# EasyEDA Pro project ProPrj_PCB_2025-05-19.epro, board 手掌0.1
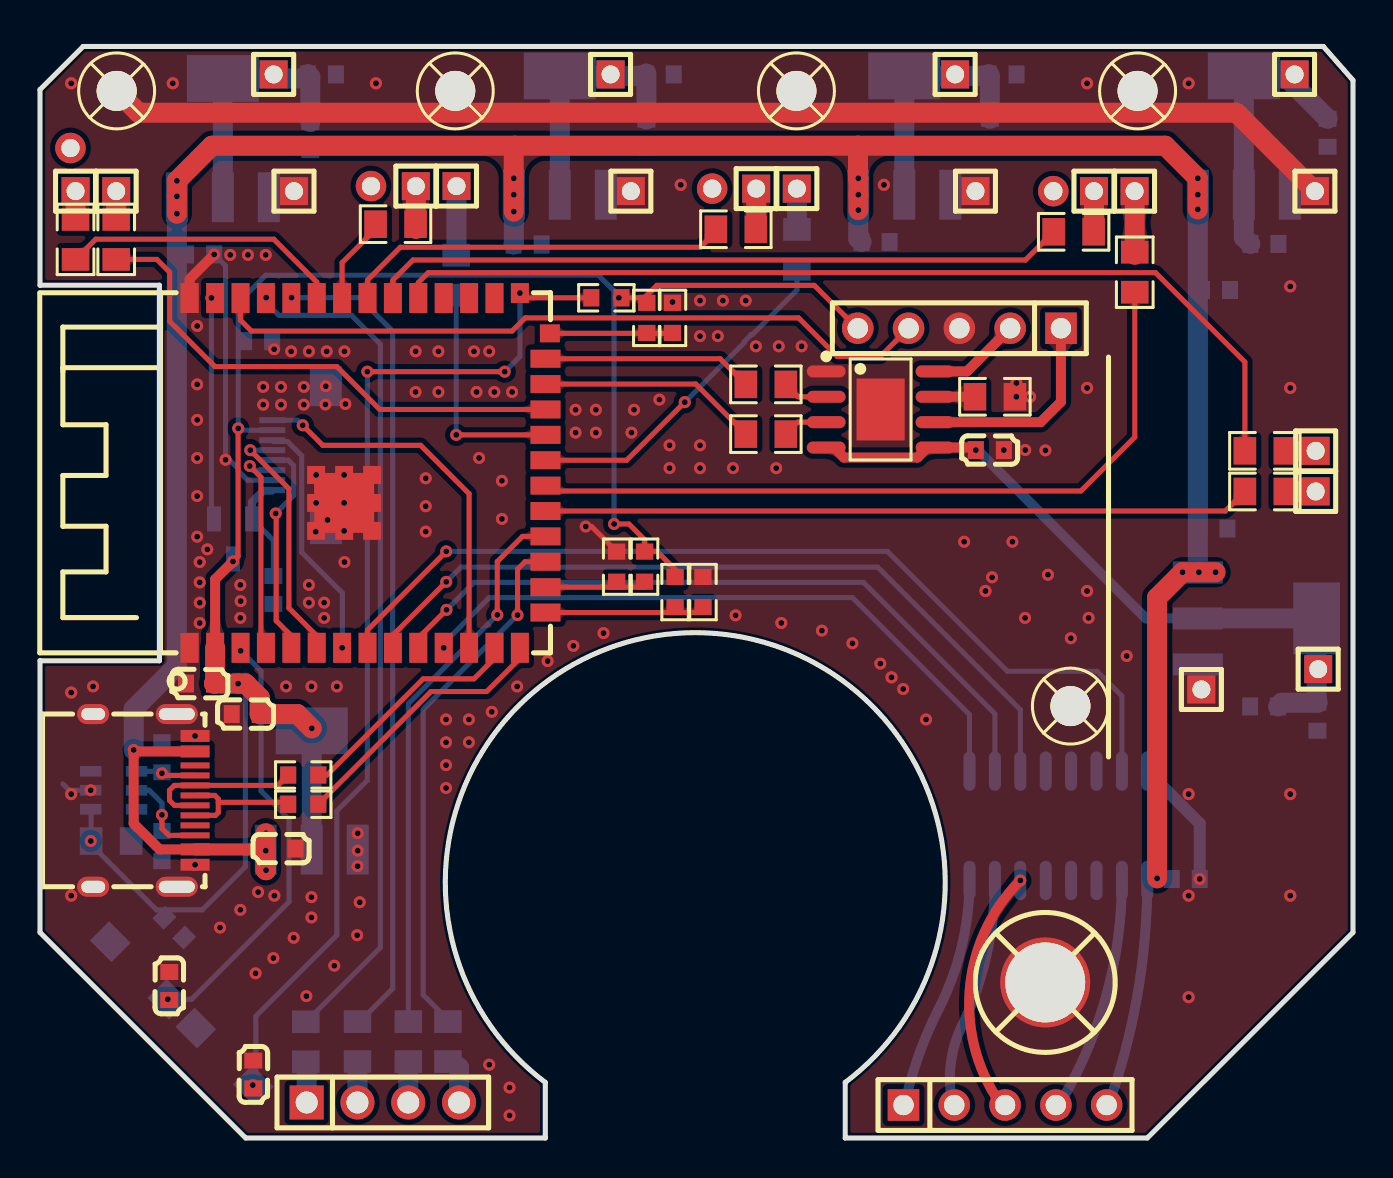
[diagram p4: board, top side]
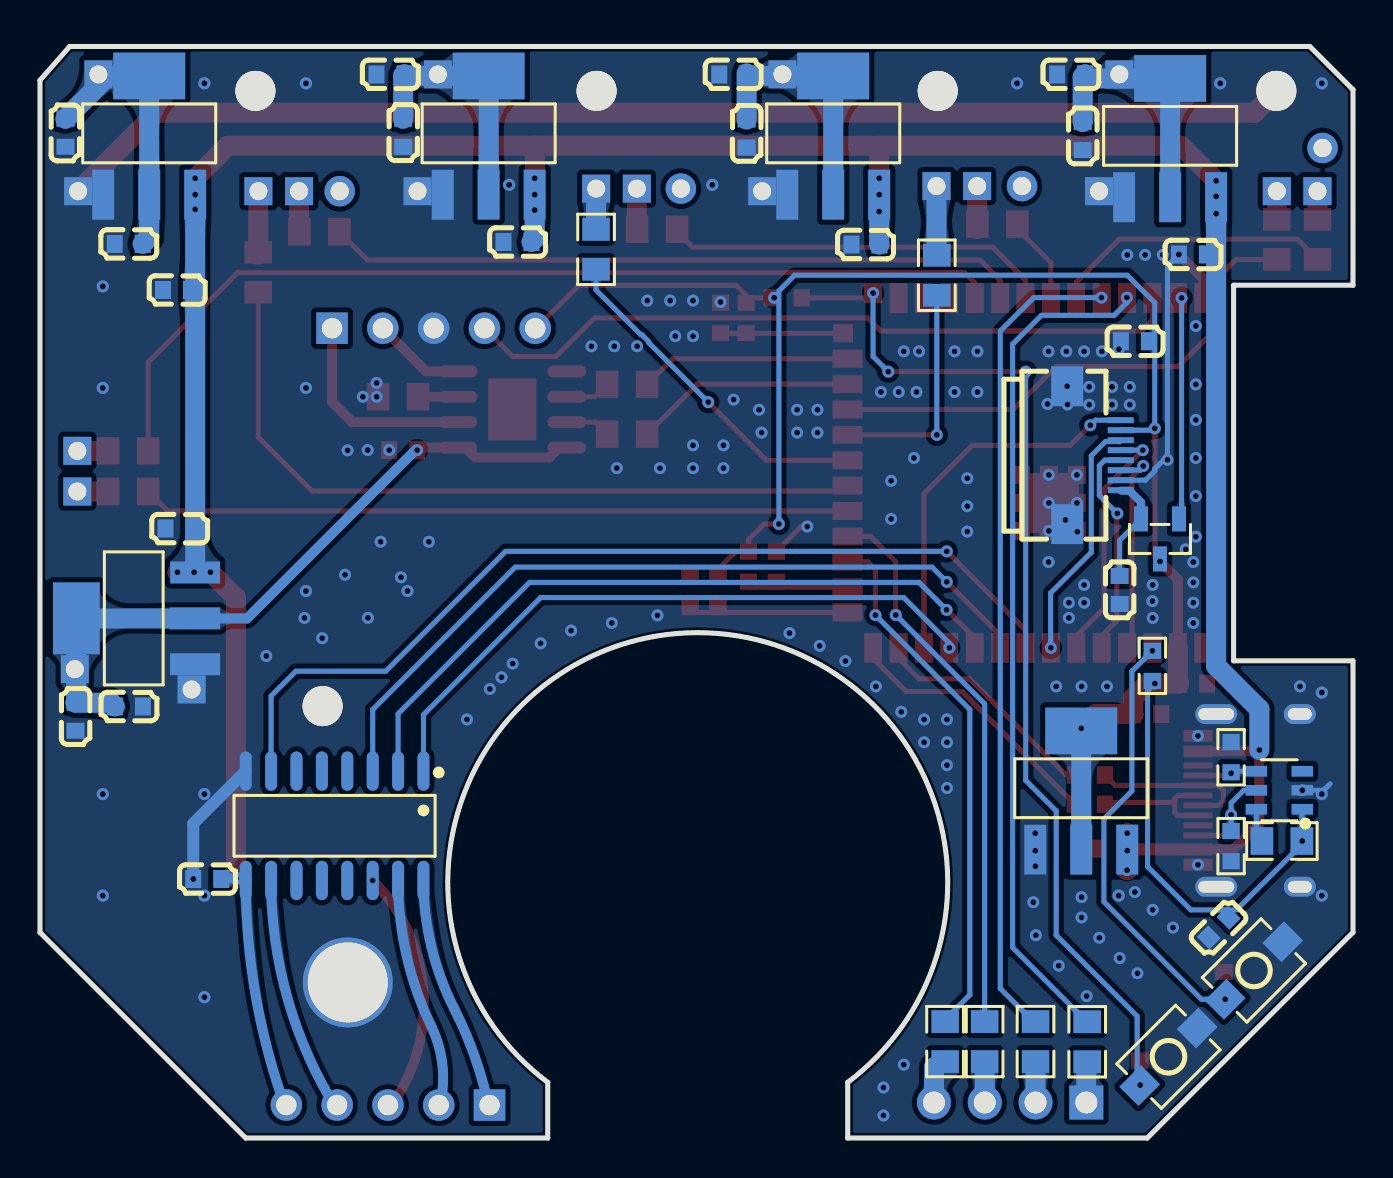
[diagram p5: board, bottom side, seen from below]

Outline 65.66 x 54.61 mm; copper layers: Top Layer, Bottom Layer. Coordinates in mm from the lower left corner of the outline.
Outline path: 0,52.45 2.16,54.61 64.17,54.61 65.66,52.92 65.66,10.29 55.37,0 40.27,0 40.27,2.78 arc(32.77,25.28) 25.27,2.78 25.27,0 10.29,0 0,10.29 0,23.88 5.97,23.88 5.97,42.67 0,42.67 0,52.45
Stack: Top Layer 0.035mm / Dielectric1 1.51mm FR4 er 4.5 / Bottom Layer 0.035mm

## Design rules (mm)
template: 自定义配置
spacing copperThickness1oz (default): track to track 0.102, other pairs 0.152 to 0.3
spacing copperThickness2oz: track to track 0.203, other pairs 0.152 to 0.3
track width copperThickness1oz (default): min 0.127, default 0.254, max 2.54
track width copperThickness2oz: min 0.203, default 0.254, max 2.54
differential pair differentialPair (default): width min 0.127, default 0.254, max 2.54; gap min 0.152, default 0.152
via viaSize (default): diameter min 0.5, default 0.61, max 10; hole min 0.3, default 0.305, max 6.3

## Placement (name value [footprint] x y rotation side)
C1  100nF  [C0603]  6.72 10.53 135 bottom
C2  100nF  [C0603]  13.52 50.13 270 bottom
C3  100nF  [C0603]  30.32 50.26 270 bottom
C4  100nF  [C0603]  47.5 50.29 270 bottom
C5  100nF  [C0603]  61.23 44.73 0 bottom
C6  100nF  [C0603]  63.88 21.08 270 bottom
C7  100nF  [C0603]  47.5 34.42 0 top
C8  100nF  [C0603]  57.29 12.96 0 bottom
C9  100nF  [C0603]  8 22.73 0 top
C10  100nF  [C0603]  10.67 3.17 270 top
C11  100nF  [C0603]  6.46 7.61 270 top
C12  100nF  [C0603]  8.01 44.21 0 bottom
C13  100nF  [C0603]  24.38 44.7 0 bottom
C14  100nF  [C0603]  41.78 44.83 0 bottom
C15  100nF  [C0603]  58.81 42.43 0 bottom
C16  100nF  [C0603]  58.68 30.49 0 bottom
C17  100nF  [C0603]  14.1 53.21 180 bottom
C18  100nF  [C0603]  30.99 53.21 180 bottom
C19  100nF  [C0603]  48.13 53.21 180 bottom
C20  100nF  [C0603]  64.39 50.29 90 bottom
C21  100nF  [C0603]  61.21 21.59 0 bottom
C22  100nF  [C0603]  12.06 14.48 0 top
C23  100nF  [C0603]  10.29 21.21 0 top
C24  100nF  [C0603]  11.67 27.42 270 bottom
C25  100nF  [C0603]  10.91 39.86 0 bottom
FPC1  AFC01-S08FCA-00  [FPC-SMD_P0.50-8P_FGS-XJ-H2.0]  12.95 34.16 90 bottom
H6  -  [HDR-TH_5P-P2.54-V-F]  45.97 40.51 180 top
H7  -  [HDR-TH_5P-P2.54-V-F]  48.26 1.65 0 top
H8  -  [HDR-TH_4P-P2.54-V-F]  17.14 1.78 0 top
H10  -  [HDR-TH_1P-V-M_XKB_X4611WV-01I-C28D40]  11.68 53.21 0 top
H11  -  [HDR-TH_1P-V-M_XKB_X4611WV-01I-C28D40]  12.7 47.37 0 top
H12  -  [HDR-TH_1P-V-M_XKB_X4611WV-01I-C28D40]  1.78 47.37 0 top
H13  -  [HDR-TH_1P-V-M_XKB_X4611WV-01I-C28D40]  3.81 47.37 0 top
H14  -  [HDR-TH_1P-V-M_XKB_X4611WV-01I-C28D40]  28.53 53.21 0 top
H15  -  [HDR-TH_1P-V-M_XKB_X4611WV-01I-C28D40]  29.55 47.37 0 top
H16  -  [HDR-TH_1P-V-M_XKB_X4611WV-01I-C28D40]  18.8 47.62 0 top
H17  -  [HDR-TH_1P-V-M_XKB_X4611WV-01I-C28D40]  20.83 47.62 0 top
H18  -  [HDR-TH_1P-V-M_XKB_X4611WV-01I-C28D40]  45.76 53.21 0 top
H19  -  [HDR-TH_1P-V-M_XKB_X4611WV-01I-C28D40]  46.78 47.37 0 top
H20  -  [HDR-TH_1P-V-M_XKB_X4611WV-01I-C28D40]  35.81 47.5 0 top
H21  -  [HDR-TH_1P-V-M_XKB_X4611WV-01I-C28D40]  37.85 47.5 0 top
H22  -  [HDR-TH_1P-V-M_XKB_X4611WV-01I-C28D40]  62.74 53.21 0 top
H23  -  [HDR-TH_1P-V-M_XKB_X4611WV-01I-C28D40]  63.75 47.37 0 top
H24  -  [HDR-TH_1P-V-M_XKB_X4611WV-01I-C28D40]  52.7 47.37 0 top
H25  -  [HDR-TH_1P-V-M_XKB_X4611WV-01I-C28D40]  54.74 47.37 0 top
H26  -  [HDR-TH_1P-V-M_XKB_X4611WV-01I-C28D40]  63.92 23.46 90 top
H27  -  [HDR-TH_1P-V-M_XKB_X4611WV-01I-C28D40]  58.08 22.44 90 top
H28  -  [HDR-TH_1P-V-M_XKB_X4611WV-01I-C28D40]  63.79 34.38 90 top
H29  -  [HDR-TH_1P-V-M_XKB_X4611WV-01I-C28D40]  63.79 32.35 90 top
NOREF  -  [Pad_e166]  33.61 47.5 0 top
NOREF#2  -  [Pad_e167]  50.67 47.37 0 top
NOREF#3  -  [Pad_e165]  16.55 47.62 0 top
NOREF#4  -  [Pad_e116]  1.52 49.53 0 top
Q1  AO3400A  [SOT-23-3_L2.9-W1.3-P1.90-LS2.4-BR]  9.65 29.97 90 bottom
R11  -  [R0603]  6.1 19.05 90 bottom
R13  -  [R0603]  6.1 14.61 270 bottom
R44  NC  [R0603]  30.34 41.03 90 top
R45  10K  [R0603]  31.63 41.03 90 top
R48  NC  [R0603]  30.23 28.58 90 top
R49  10K  [R0603]  28.84 28.58 90 top
R50  10K  [R0603]  10.03 23.62 270 bottom
R51  10K  [R0603]  28.32 42.04 0 top
R53  22  [R0603]  13.16 18.16 180 top
R54  22  [R0603]  13.16 16.7 180 top
R55  47K  [R0805]  3.56 14.86 0 bottom
R56  10K  [R0805]  1.78 44.96 270 top
R57  10K  [R0805]  3.81 44.96 270 top
R58  10K  [R0805]  17.78 45.72 180 top
R59  10K  [R0805]  20.81 43.17 270 bottom
R60  10K  [R0805]  34.8 45.47 180 top
R61  10K  [R0805]  37.85 44.46 270 bottom
R62  10K  [R0805]  51.69 45.34 180 top
R63  10K  [R0805]  54.74 43.32 270 top
R64  10K  [R0805]  61.25 34.38 180 top
R65  10K  [R0805]  61.25 32.35 180 top
R66  10K  [R0805]  13.29 4.81 270 bottom
R67  10K  [R0805]  15.87 4.83 270 bottom
R68  10K  [R0805]  36.3 35.22 180 top
R69  10K  [R0805]  36.3 37.7 180 top
R70  5Ω  [R0805]  47.75 37.08 180 top
R71  10K  [R0603]  31.76 27.31 90 top
R72  NC  [R0603]  33.15 27.31 90 top
R73  10K  [R0805]  18.42 4.82 270 bottom
R74  10K  [R0805]  20.4 4.82 270 bottom
SW1  -  [Key_SMD_3x4x2]  4.95 8.38 135 bottom
SW2  -  [Key_SMD_3x4x2]  9.23 4.06 135 bottom
TP1  -  [M2螺丝]  3.83 52.39 0 top
TP2  -  [M2螺丝]  20.77 52.39 0 top
TP3  -  [M2螺丝]  37.83 52.39 0 top
TP4  -  [M2螺丝]  54.89 52.39 0 top
TP7  -  [M2螺丝]  51.53 21.61 270 top
TP8  -  [M4螺丝]  50.27 7.78 0 top
U2  ESP32-S3-WROOM-1-N16R8  [esp32s3-woom-1]  16.38 33.27 90 top
U33  A4950ELJTR-T  [SOIC-8_L4.9-W3.9-P1.27-LS6.0-BL-EP]  42.04 36.45 270 top
U34  ULN2003ADR  [SOIC-16_L9.9-W3.9-P1.27-LS6.0-BL]  50.93 15.62 0 bottom
U35  SSP1117-3.3V  [SOT-223-3_L6.5-W3.4-P2.30-LS7.0-BR]  9.14 50.04 270 bottom
U36  SSP1117-3.3V  [SOT-223-3_L6.5-W3.4-P2.30-LS7.0-BR]  25.99 50.16 270 bottom
U37  SSP1117-3.3V  [SOT-223-3_L6.5-W3.4-P2.30-LS7.0-BR]  43.22 50.16 270 bottom
U38  SSP1117-3.3V  [SOT-223-3_L6.5-W3.4-P2.30-LS7.0-BR]  60.2 50.16 270 bottom
U39  SSP1117-3.3V  [SOT-223-3_L6.5-W3.4-P2.30-LS7.0-BR]  60.87 26 180 bottom
U40  CH221K  [SOT-23-6_L2.9-W1.6-P0.95-LS2.9-BL]  3.68 17.4 90 bottom
U41  SSP1117-3.3V  [SOT-223-3_L6.5-W3.4-P2.30-LS7.0-BR]  13.59 17.4 270 bottom
USB1  -  [USB-C-SMD_TYPEC-304-BCP16]  5.21 16.89 270 top

## Footprints (pads in the part's own frame, mm; a bottom-side part is the same pattern mirrored in y, then rotated)
C0603
  rect 0.8x0.9 smd: 1(-0.7,0) 2(0.7,0)
esp32s3-woom-1
  rect 1.5x0.9 smd: 1(-8.75,8.895) 2(-8.75,7.625) 3(-8.75,6.355) 4(-8.75,5.085) 5(-8.75,3.815) 6(-8.75,2.545) 7(-8.75,1.275) 8(-8.75,0.005) 9(-8.75,-1.265) 10(-8.75,-2.535) 11(-8.75,-3.805) 12(-8.75,-5.075) 13(-8.75,-6.345) 14(-8.75,-7.615) 28(8.75,-6.345) 29(8.75,-5.075) 30(8.75,-3.805) 31(8.75,-2.535) 32(8.75,-1.265) 33(8.75,0.005) 34(8.75,1.275) 35(8.75,2.545) 36(8.75,3.815) 37(8.75,5.085) 38(8.75,6.355) 39(8.75,7.625) 40(8.75,8.895)
  rect 0.9x1.5 smd: 15(-6.985,-8.895) 16(-5.715,-8.895) 17(-4.445,-8.895) 18(-3.175,-8.895) 19(-1.905,-8.895) 20(-0.635,-8.895) 21(0.635,-8.895) 22(1.905,-8.895) 23(3.175,-8.895) 24(4.445,-8.895) 25(5.715,-8.895)
  rect 0.9x1 smd: 26(6.985,-9.115)
  rect 1x0.9 smd: 27(9.001,-7.615)
  rect 0.9x0.9 smd: 41(-2.9,2.575) 41(-2.9,1.175) 41(-2.9,-0.225) 41(-1.5,2.575) 41(-1.5,-0.225) 41(-0.1,2.575) 41(-0.1,1.175) 41(-0.1,-0.225)
  rect 3x3 smd: 41(-1.5,1.175)
FPC-SMD_P0.50-8P_FGS-XJ-H2.0
  rect 0.3x1.3 smd: 1(-1.75,-1.34) 2(-1.252,-1.339) 3(-0.75,-1.34) 4(-0.25,-1.34) 5(0.25,-1.34) 6(0.75,-1.34) 7(1.25,-1.34) 8(1.75,-1.34)
  rect 2x1.6 smd: 9(3.45,1.34) 10(-3.45,1.34)
HDR-TH_1P-V-M_XKB_X4611WV-01I-C28D40
  rect 1.4x1.4 hole 0.9: 1(0,0)
HDR-TH_4P-P2.54-V-F
  rect 1.7x1.7 hole 1.1: 1(-3.81,0)
  round 1.7 hole 1.1: 2(-1.27,0) 3(1.27,0) 4(3.81,0)
HDR-TH_5P-P2.54-V-F
  rect 1.575x1.575 hole 1.02: 1(-5.08,0)
  round 1.575 hole 1.02: 2(-2.54,0) 3(0,0) 4(2.54,0) 5(5.08,0)
Key_SMD_3x4x2
  rect 1.53x1.36 smd: 1(-2.035,0) 2(2.035,0)
M2螺丝
  round 2 hole 2: 1(0,0)
M4螺丝
  round 4.5 hole 4: 1(0,0)
Pad_e116
  round 1.524 hole 0.914: 1(0,0)
Pad_e165
  round 1.524 hole 0.914: 1(0,0)
Pad_e166
  round 1.524 hole 0.914: 1(0,0)
Pad_e167
  round 1.524 hole 0.914: 1(0,0)
R0603
  rect 0.806x0.864 smd: 1(-0.753,0) 2(0.753,0)
R0805
  rect 1.133x1.377 smd: 1(-1,0) 2(1,0)
SOIC-8_L4.9-W3.9-P1.27-LS6.0-BL-EP
  oval 0.602x1.941 smd: 1(-1.905,-2.72) 2(-0.635,-2.72) 3(0.635,-2.72) 4(1.905,-2.72) 5(1.905,2.72) 6(0.635,2.72) 7(-0.635,2.72) 8(-1.905,2.72)
  rect 3.098x2.41 smd: 9(0,0)
SOIC-16_L9.9-W3.9-P1.27-LS6.0-BL
  oval 0.602x1.971 smd: 1(-4.445,-2.736) 2(-3.175,-2.736) 3(-1.905,-2.736) 4(-0.635,-2.736) 5(0.635,-2.736) 6(1.905,-2.736) 7(3.175,-2.736) 8(4.445,-2.736) 9(4.445,2.736) 10(3.175,2.736) 11(1.905,2.736) 12(0.635,2.736) 13(-0.635,2.736) 14(-1.905,2.736) 15(-3.175,2.736) 16(-4.445,2.736)
SOT-23-3_L2.9-W1.3-P1.90-LS2.4-BR
  rect 1.25x0.7 smd: 1(1,-0.95) 2(1,0.95) 3(-1,0)
SOT-23-6_L2.9-W1.6-P0.95-LS2.9-BL
  rect 0.532x1.072 smd: 1(-0.95,-1.149) 2(0,-1.149) 3(0.95,-1.149) 4(0.95,1.149) 5(0,1.149) 6(-0.95,1.149)
SOT-223-3_L6.5-W3.4-P2.30-LS7.0-BR
  rect 2.5x1.1 smd: 1(2.97,-2.3) 2(2.97,0) 3(2.97,2.3)
  rect 2.34x3.6 smd: 4(-2.97,0)
USB-C-SMD_TYPEC-304-BCP16
  oval 1.001x2.1 hole 0.6x1.801: 13(-4.321,1.633) 14(4.321,1.633)
  oval 1.001x1.6 hole 0.6x1.199: 15(-4.321,-2.547) 16(4.321,-2.547)
  rect 0.6x1.45 smd: A1B12(-3.226,2.547) A4B9(-2.451,2.547) B1A12(3.22,2.547) B4A9(2.451,2.547)
  rect 0.299x1.45 smd: A5(-1.25,2.547) A6(-0.249,2.547) A7(0.249,2.547) A8(1.25,2.547) B5(1.75,2.547) B6(0.75,2.547) B7(-0.75,2.547) B8(-1.75,2.547)

## Nets
GND: C1.1 C2.2 C3.2 C4.2 C5.2 C6.2 C7.2 C8.2 C9.1 C10.1 C11.1 C12.2 C13.2 C14.2 C15.2 C16.2 C17.1 C18.1 C19.1 C20.1 C21.1 C22.2 C23.1 C24.2 C25.2 FPC1.2 FPC1.9 FPC1.10 H6.3 H11.1 H15.1 H19.1 H23.1 H27.1 R11.2 R13.2 R45.2 R49.2 R70.1 R72.2 SW1.2 SW2.2 TP1.1 TP2.1 TP3.1 TP4.1 TP7.1 TP8.1 U2.1 U2.40 U2.41 U33.1 U33.9 U34.8 U35.1 U36.1 U37.1 U38.1 U39.1 U40.2 U41.1 USB1.13 USB1.14 USB1.15 USB1.16 USB1.A1B12 USB1.B1A12
VBUS: C8.1 C12.1 C13.1 C14.1 C15.1 C16.1 C22.1 H7.5 U34.9 U35.3 U36.3 U37.3 U38.3 U39.3 U41.3 USB1.A4B9 USB1.B4A9
VCC: C1.2 C9.2 C23.2 C25.1 FPC1.7 H6.5 Q1.3 R44.2 R48.2 R50.2 R51.2 R55.1 R71.2 U2.2 U40.1 U41.2 U41.4
VCC1OUT3V3: C2.1 C17.2 H10.1 U35.2 U35.4
VCC2OUT3V3: C3.1 C18.2 H14.1 U36.2 U36.4
VCC3OUT3V3: C4.1 C19.2 H18.1 U37.2 U37.4
VCC4OUT3V3: C5.1 C20.2 H22.1 U38.2 U38.4
VCC5OUT3V3: C6.1 C7.1 C21.2 H26.1 U33.4 U33.5 U39.2 U39.4
CC1: R11.1 U40.4 USB1.A5
CC2: R13.1 U40.5 USB1.B5
CHIP_PU: C11.2 R50.1 SW1.1 U2.3
D+: R54.2 USB1.A6 USB1.B6
D-: R53.2 USB1.A7 USB1.B7
GPIO0: C10.2 R51.1 SW2.1 U2.27
GPIO1: Q1.1 U2.39
GPIO2: H6.4 U2.38
GPIO3: R71.1 R72.1 U2.15
GPIO4: FPC1.3 U2.4
GPIO5: FPC1.4 U2.5
GPIO6: FPC1.5 U2.6
GPIO7: FPC1.6 U2.7
GPIO8: FPC1.8 U2.12
GPIO9: R74.1 U2.17
GPIO10: R73.1 U2.18
GPIO11: R65.2 U2.19
GPIO12: R63.2 U2.20
GPIO13: R61.2 U2.21
GPIO14: R59.2 U2.22
GPIO15: U2.8 U34.7
GPIO16: U2.9 U34.3
GPIO17: U2.10 U34.2
GPIO18: U2.11 U34.1
GPIO19: R53.1 U2.13
GPIO20: R54.1 U2.14
GPIO21: R57.2 U2.23
GPIO35: U2.28
GPIO36: U2.29
GPIO37: U2.30
GPIO38: R64.2 U2.31
GPIO39: R62.2 U2.32
GPIO40: R60.2 U2.33
GPIO41: R58.2 U2.34
GPIO42: R56.2 U2.35
GPIO45: R44.1 R45.1 U2.26
GPIO46: R48.1 R49.1 U2.16
GPIO47: R68.2 U2.24
GPIO48: R69.2 U2.25
OUT1: H6.1 U33.6
OUT2: H6.2 U33.8
U0RXD: R67.1 U2.36
U0TXD: R66.1 U2.37
$1N4196: R55.2 U40.6
$1N4747: H12.1 R56.1
$1N4751: H16.1 R58.1
$1N4755: H20.1 R60.1
$1N4759: H24.1 R62.1
$1N4763: H28.1 R64.1
$1N4767: H13.1 R57.1
$1N4772: H17.1 R59.1
$1N4776: H21.1 R61.1
$1N4780: H25.1 R63.1
$1N4784: H29.1 R65.1
$1N4788: R69.1 U33.2
$1N4792: R68.1 U33.3
$1N5339: R70.2 U33.7
$1N6297: C24.1 FPC1.1 Q1.2
$1N6729: H8.1 R66.2
$1N6731: H8.2 R67.2
$1N6815: H8.3 R73.2
$1N6817: H8.4 R74.2
$1N7401: H7.1 U34.16
$1N7406: H7.2 U34.15
$1N7413: H7.3 U34.14
$1N7419: H7.4 U34.10

Pads without a net: NOREF 1; NOREF#2 1; NOREF#3 1; NOREF#4 1; U34 4 5 6 11 12 13; U40 3; USB1 A8 B8

## Via types
v1: diameter 0.6, hole 0.3, Top Layer to Bottom Layer, 194 vias
v2: diameter 0.61, hole 0.305, Top Layer to Bottom Layer, 22 vias

## Routing (per net, layer and track width the routed paths; a pad name or vN(x,y) marks a point on that pad's centre or on a via; arc(x,y) is an arc through that point)
GND: length 88
  Top Layer w0.254: R49.2 27.58,30.59 v1(27.29,30.59)
  Top Layer w0.5: v1(8.71,44.21) 7.49,42.99 U2.40
  Top Layer w1: H23.1 59.83,51.29 4.93,51.29 TP1.1
  Bottom Layer w0.254: 1.14,17.72 1.46,17.4 v1(2.53,17.4) ; v1(9.28,33.93) 9.28,43.64 v1(8.71,44.21) ; FPC1.2 10.38,32.91 9.91,33.38 9.91,33.48 9.41,33.98
  Bottom Layer w0.6: U34.8 57.99,15.74 v1(57.99,12.96)
  vias: v1(2.65,22.59) v1(7.75,20.12) v1(7.75,13.67) v1(7.86,40.63) v1(7.86,37.7) v1(7.86,35.93) v1(7.86,34.02) v1(7.86,32.12) v1(7.86,30.08) v1(7.99,28.81) v1(7.99,27.8) v1(7.99,26.78) v1(7.99,25.77) v1(8.37,29.45) v1(9,10.53) v1(9.51,44.18) v1(10.02,27.67) v1(10.03,26.86) v1(10.02,26.02) v1(10.02,11.42) v1(10.4,44.18) v1(10.78,8.24) v1(10.91,12.3) v1(11.16,37.58) v1(11.16,36.69) v1(11.29,44.18) v1(11.67,9) v1(11.71,39.46) v1(12.05,37.58) v1(12.05,36.69) v1(12.3,22.59) v1(12.56,39.36) v1(12.68,10.02) v1(13.19,37.58) v1(13.19,36.69) v1(13.32,7.1) v1(13.45,39.36) v1(13.45,27.67) v1(13.45,26.78) v1(13.57,22.59) v1(13.57,12.05) v1(13.57,11.03) v1(13.79,30.33) v1(13.81,33.17) v1(13.81,31.77) v1(14.27,36.7) v1(14.21,26.78) v1(14.21,26.02) v1(14.34,39.36) v1(14.29,37.61) v1(14.38,30.92) v1(14.72,8.62) v1(14.84,22.59) v1(15.23,39.36) v1(15.27,36.72) v1(15.21,33.17) v1(15.21,31.77) v1(15.21,30.37) v1(15.23,28.81) v1(15.89,15.25) v1(15.89,14.37) v1(15.88,13.6) v1(15.86,10.15) v1(15.99,11.8) v1(18.78,39.36) v1(18.78,37.32) v1(19.29,33.01) v1(19.29,31.61) v1(19.29,30.34) v1(19.92,39.36) v1(19.92,37.32) v1(20.3,20.94) v1(20.3,19.8) v1(20.3,18.66) v1(20.3,17.51) v1(21.45,20.94) v1(21.45,19.8) v1(21.7,39.36) v1(21.83,37.32) v1(21.96,34.02) v1(22.46,39.36) v1(22.46,3.67) v1(22.59,21.32) v1(22.72,37.32) v1(23.1,32.88) v1(23.1,30.97) v1(23.48,2.53) v1(23.48,1.13) v1(23.61,37.32) v1(23.86,22.59) v1(25.39,23.86) v1(26.67,24.62) v1(26.78,36.44) v1(26.78,35.29) v1(27.8,36.44) v1(27.8,35.29) v1(28.18,25.26) v1(29.58,35.29) v1(29.7,36.44) v1(30.97,36.94) v1(31.48,34.66) v1(31.48,33.51) v1(31.63,41.83) v1(33.01,41.9) v1(33.01,40.12) v1(33.01,34.66) v1(33.01,33.51) v1(33.89,40.12) v1(34.15,41.9) v1(34.66,33.51) v1(34.78,26.15) v1(35.29,41.9) v1(35.8,39.61) v1(36.81,33.51) v1(36.94,39.61) v1(37.07,25.77) v1(38.08,39.61) v1(39.1,25.39) v1(40.62,24.75) v1(42.02,23.73) v1(43.17,22.47) v1(44.31,20.94) v1(46.21,29.83) v1(47.61,28.05) v1(48.2,34.42) v1(48.63,29.83) v1(48.83,37.77) v1(48.82,37.08) v1(49.27,34.42) v1(49.26,26.02) v1(49.51,37.08) v1(50.28,34.4) v1(50.4,28.18) v1(51.55,25) v1(52.44,26.02) v1(54.34,24.12) v2(1.56,52.77) v2(1.56,22.29) v2(1.56,17.21) v2(1.56,12.13) v2(6.64,52.77) v2(11.72,12.13) v2(16.8,52.77) v2(32.04,47.69) v2(42.2,47.69) v2(42.58,23.05) v2(47.28,27.37) v2(52.36,52.77) v2(52.36,37.53) v2(52.36,27.37) v2(57.44,52.77) v2(57.44,17.21) v2(57.44,12.13) v2(57.44,7.05) v2(62.52,42.61) v2(62.52,37.53) v2(62.52,17.21) v2(62.52,12.13)
VBUS: length 159.4
  Top Layer w0.5: 4.68,19.39 v1(4.68,19.42) ; 4.68,19.39 4.68,15.73 5.98,14.44 USB1.B4A9 ; 4.68,19.39 4.73,19.34 7.75,19.34
  Top Layer w0.6: 11.28,14.44 USB1.B4A9
  Top Layer w1: 23.73,49.64 40.9,49.64 ; 23.73,49.64 8.6,49.64 v1(6.84,47.89) v1(6.84,47.11) v1(6.84,46.24) ; 23.73,49.64 23.69,49.6 v1(23.69,48.02) v1(23.69,47.19) v1(23.69,46.35) ; 40.9,49.64 40.9,48.03 v1(40.92,48.02) v1(40.92,47.19) v1(40.92,46.42) ; 40.9,49.64 56.27,49.64 v1(57.9,48.02) v1(57.9,47.19) v1(57.9,46.46) ; v1(55.86,12.99) 55.86,27.03 v1(57.14,28.31) v1(57.95,28.31) v1(58.79,28.31) ; 11.28,14.36 11.28,14.44 ; 11.28,14.36 11.28,13.42 v1(11.3,13.4) 11.28,14.36 ; v1(11.29,15.25) 11.29,14.5
  Bottom Layer w0.5: C8.1 56.56,12.99 v1(55.86,12.99) ; U34.9 arc(54.86,7.05) 53.34,1.4
  Bottom Layer w0.6: U34.9 55.48,12.99 v1(55.86,12.99)
  Bottom Layer w1: U35.3 v1(6.84,46.24) 6.84,23.62 4.68,21.46 v1(4.68,19.42) ; v1(23.69,46.35) 23.69,44.71 23.68,44.7 ; v1(57.9,46.46) 57.9,28.3 U39.3 ; C14.1 40.92,44.99 v1(40.92,46.42)
  vias: v1(11.29,14.37)
VCC: length 103.4
  Top Layer w0.254: v1(9.65,28.84) 9.91,29.1 9.91,35.5 v1(9.91,35.5) ; 30.23,29.35 30.86,29.35 31.76,28.45 R71.2 ; 30.23,29.35 30.23,29.94 29.45,30.72 v1(28.71,30.72) ; 30.23,29.35 R48.2 ; R44.2 30.09,42.04 ; 30.09,42.04 v1(28.95,42.04) ; 30.09,42.04 30.23,42.04 30.85,42.66 38.72,42.66 40.86,40.51 H6.5
  Top Layer w0.5: U2.2 8.76,27.95 v1(9.65,28.84)
  Top Layer w1: v1(13.59,20.5) 12.88,21.21 C23.2 10.99,22.03 10.29,22.73 v1(9.91,22.73) C9.2 8.76,22.79 U2.2
  Bottom Layer w0.254: v1(28.71,30.72) 28.71,42.38 27.92,43.17 11.29,43.17 9.91,41.79 v1(9.91,35.5) 10,35.41 FPC1.7 ; 2.4,16.32 U40.1 2.56,16.43 R55.1 ; v1(2.54,14.86) 2.54,14.7 5.83,11.42 8.11,11.42 10.27,13.58 10.27,22.37 v1(9.91,22.73)
  Bottom Layer w1: 13.59,15.44 v1(13.59,20.5)
VCC1OUT3V3: length 12.7
  Bottom Layer w1: C2.1 13.52,53.09 C17.2 13.19,53.01 U35.4 U35.2
VCC2OUT3V3: length 12.6
  Bottom Layer w1: C3.1 30.32,53.26 ; C18.2 30.21,53.13 U36.4 U36.2
VCC3OUT3V3: length 12.4
  Bottom Layer w1: U37.2 U37.4 47.36,53.13 C19.2 47.5,53.15 C4.1
VCC4OUT3V3: length 13.6
  Bottom Layer w1: C5.1 60.2,45.06 U38.2 U38.4 62.25,53.13 C20.2
VCC5OUT3V3: length 34.7
  Top Layer w0.5: U33.4 39.7,34.54 40.2,34.05 43.88,34.05 44.38,34.54 U33.5 46.67,34.54 v1(46.8,34.42)
  Bottom Layer w0.5: U39.2 55.3,26 46.87,34.43
  Bottom Layer w1: 61.91,21.59 62.1,21.78 C6.1 63.84,21.82 U39.4 U39.2
CC1: length 3
  Top Layer w0.254: 6.1,18.29 6.24,18.14 USB1.A5
  Bottom Layer w0.254: U40.4 6,18.35 v1(6.1,18.25)
CC2: length 5.4
  Top Layer w0.254: USB1.B5 6.45,15.14 6.1,15.49 v1(6.1,16.17)
  Bottom Layer w0.254: U40.5 5.46,17.4 6.1,16.76 v1(6.1,16.17) R13.1
CHIP_PU: length 21.6
  Bottom Layer w0.254: v1(10.03,24.38) 11.06,23.35 11.06,17.36 12.45,15.97 12.45,11.82 7.58,6.94 v1(6.39,6.94)
D+: length 6.7
  Top Layer w0.254: USB1.A6 8.74,17.14 8.92,16.96 8.92,16.8 ; 8.92,16.8 12.32,16.8 R54.2 ; 8.92,16.8 8.92,16.28 8.78,16.14 USB1.B6
D-: length 8.1
  Top Layer w0.254: USB1.A7 6.73,16.64 6.48,16.89 6.48,17.4 6.72,17.64 USB1.B7 11.89,17.64 R53.2
GPIO0: length 52.8
  Top Layer w0.254: R51.1 24.01,42.04 24,42.02 ; v1(16.37,38.34) v1(23.24,38.34)
  Bottom Layer w0.254: v1(23.24,38.34) 24,39.1 v1(24,42.27) ; v1(16.37,38.34) 16.37,17.89 14.84,16.37 14.84,10.15 10.79,6.1 10.79,2.75 SW2.1
  vias: v1(10.64,2.65)
GPIO1: length 11.3
  Top Layer w0.254: U2.39 8.75,42.03 v1(8.57,42.03)
  Bottom Layer w0.254: Q1.1 8.57,31.1 v1(8.57,42.03)
GPIO2: length 36.4
  Top Layer w0.254: H6.4 42.02,39.1 39.86,39.1 37.93,41.03 24.26,41.03 23.61,40.37 10.57,40.37 10.03,40.92 U2.38
GPIO3: length 8
  Top Layer w0.254: U2.15 32.76,26.29 33.15,26.69
GPIO4: length 10.7
  Top Layer w0.254: v1(10.49,33.62) 11.05,33.06 11.05,24.77 U2.4
  Bottom Layer w0.254: FPC1.3 10.63,33.41 10.49,33.55 v1(10.49,33.62)
GPIO5: length 11
  Top Layer w0.254: U2.5 12.57,25.12 11.81,25.88 11.81,31.22 v1(11.79,31.25)
  Bottom Layer w0.254: v1(11.79,31.25) 12.68,32.14 12.68,33.64 12.41,33.91 FPC1.4
GPIO6: length 12.4
  Top Layer w0.254: U2.6 13.84,25.12 12.45,26.51 12.45,32.48 v1(10.52,34.41)
  Bottom Layer w0.254: FPC1.5 v1(10.52,34.41)
GPIO7: length 12.3
  Bottom Layer w0.254: FPC1.6 11.68,34.84 12.38,34.84 13.09,34.13 13.09,29.3 15.12,27.27 15.12,24.52
  vias: v1(15.11,24.52)
GPIO8: length 19.1
  Top Layer w0.254: v1(13.14,35.66) 14.14,34.66 19.03,34.66 21.46,32.23 U2.12
  Bottom Layer w0.254: FPC1.8 12.88,35.91 v1(13.14,35.66)
GPIO9: length 26.9
  Top Layer w0.254: v1(23.88,26.16) 23.88,28.46 24.25,28.83 U2.17
  Bottom Layer w0.254: 20.4,5.57 20.4,5.93 19.16,7.16 19.16,21.44 v1(23.88,26.16)
GPIO10: length 28
  Top Layer w0.254: U2.18 24.13,30.1 22.87,28.84 v1(22.87,26.17)
  Bottom Layer w0.254: v1(22.87,26.17) 18.42,21.72 18.42,5.57
GPIO11: length 35.4
  Top Layer w0.254: R65.2 59.27,31.37 U2.19
GPIO12: length 37.8
  Top Layer w0.254: 54.74,42.19 54.74,35.06 52.05,32.37 25.55,32.37 U2.20
GPIO13: length 17
  Top Layer w0.254: v1(32.24,36.82) 29.34,33.91 U2.21
  Bottom Layer w0.254: 37.85,43.33 37.85,42.43 35.62,40.19 35.56,40.19 35.22,39.85 35.22,39.79 v1(32.24,36.82)
GPIO14: length 11.5
  Top Layer w0.254: U2.22 v1(20.81,35.18)
  Bottom Layer w0.254: v1(20.81,35.18) R59.2
GPIO15: length 47
  Top Layer w0.254: v1(20.31,29.35) 16.38,25.41 U2.8
  Bottom Layer w0.254: U34.7 54.1,22.11 52.86,23.35 48.37,23.35 42.38,29.35 v1(20.31,29.35)
GPIO16: length 39.4
  Top Layer w0.254: U2.9 17.65,25.16 v1(20.31,27.83)
  Bottom Layer w0.254: v1(20.31,27.83) 21.05,28.56 41.89,28.56 49.02,21.43 U34.3
GPIO17: length 36.1
  Top Layer w0.254: v1(20.33,26.43) 18.92,25.02 U2.10
  Bottom Layer w0.254: U34.2 47.75,21.23 41.18,27.8 21.7,27.8 v1(20.33,26.43)
GPIO18: length 32.7
  Bottom Layer w0.254: v1(20.19,24.52) 20.19,24.76 22.46,27.04 40.62,27.04 46.48,21.18 U34.1
GPIO19: length 11.8
  Top Layer w0.254: R53.1 14.35,18.16 19.16,22.97 21.7,22.97 22.73,24 U2.13
GPIO20: length 13.6
  Top Layer w0.254: R54.1 19.55,22.34 22.34,22.34 24,24 U2.14
GPIO21: length 26
  Top Layer w0.254: R57.2 5.84,43.96 6.48,43.32 6.48,40.86 8.75,38.59 14.84,38.59 16.99,36.45 U2.23
GPIO38: length 48.6
  Top Layer w0.254: R64.2 60.25,38.82 55.78,43.29 19.41,43.29 18.92,42.8 U2.31
GPIO39: length 34.9
  Top Layer w0.254: U2.32 17.65,42.92 18.65,43.93 49.28,43.93 R62.2
GPIO40: length 19.3
  Top Layer w0.254: U2.33 16.38,42.92 18.02,44.56 33.02,44.56 33.8,45.34
GPIO41: length 4.1
  Top Layer w0.254: U2.34 15.11,43.79 16.78,45.47
GPIO42: length 14.2
  Top Layer w0.254: U2.35 13.84,42.82 11.69,44.97 2.79,44.97 R56.2
GPIO45: length 6.4
  Top Layer w0.254: R45.1 31.61,40.26 25.25,40.26
GPIO46: length 5
  Top Layer w0.254: U2.16 30.21,27.56 30.23,27.58
GPIO47: length 11.1
  Top Layer w0.254: U2.24 32.8,37.72 R68.2
GPIO48: length 10.6
  Top Layer w0.254: R69.2 34.01,38.99 U2.25
OUT1: length 10.4
  Top Layer w0.5: U33.6 50.04,35.81 51.05,36.83 H6.1
OUT2: length 4.7
  Top Layer w0.5: H6.2 46.36,38.35 U33.8
U0RXD: length 41.3
  Bottom Layer w0.254: 15.87,5.57 15.87,5.72 17.64,7.48 17.64,40.37 15.96,42.05 v1(12.58,42.05)
U0TXD: length 42.5
  Bottom Layer w0.254: 13.29,5.56 13.29,5.8 17.02,9.53 17.02,39.72 15.58,41.16 11.95,41.16 11.31,41.79 v1(11.31,42.05)
$1N4196: length 1.7
  Bottom Layer w0.254: U40.6 4.83,15.13 R55.2
$1N4747: length 1.4
  Top Layer w1: R56.1 H12.1
$1N4751: length 1.9
  Top Layer w1: 18.8,45.48 18.8,47.37
$1N4755: length 2
  Top Layer w1: R60.1 35.81,45.48 H20.1
$1N4759: length 2
  Top Layer w1: H24.1 52.7,45.36 R62.1
$1N4763: length 1.5
  Top Layer w1: R64.1 H28.1
$1N4767: length 1.4
  Top Layer w1: R57.1 H13.1
$1N4772: length 3.2
  Bottom Layer w1: R59.1 20.83,44.18 20.83,47.37
$1N4776: length 2
  Bottom Layer w1: H21.1 37.85,47.49 R61.1
$1N4780: length 3.2
  Top Layer w1: H25.1 54.74,47.36 54.74,44.19
$1N4784: length 1.5
  Top Layer w1: R65.1 H29.1
$1N4788: length 2.3
  Top Layer w0.254: U33.2 37.92,37.08 R69.1
$1N4792: length 2.3
  Top Layer w0.254: R68.1 37.89,35.81 U33.3
$1N5339: length 2
  Top Layer w0.5: U33.7 R70.2
$1N6297: length 5.4
  Bottom Layer w0.254: C24.1 11.67,29.91 Q1.2
  Bottom Layer w0.4: Q1.2 10.6,31.81 11.18,32.38 11.59,32.38
$1N6729: length 2.1
  Bottom Layer w1: 13.29,3.56 13.33,3.52 13.33,1.52
$1N6731: length 2
  Bottom Layer w1: 15.87,3.57 15.87,1.52
$1N6815: length 2
  Bottom Layer w1: 18.42,1.52 18.42,1.53 18.42,3.57
$1N6817: length 2.1
  Bottom Layer w1: 20.91,3.57 20.95,3.52 20.95,1.52
$1N7401: length 12
  Bottom Layer w0.5: U34.16 arc(46.09,9.58) 44.94,6.46 arc(43.89,3.99) 43.18,1.4
$1N7406: length 11.8
  Bottom Layer w0.5: 45.72,1.4 arc(45.52,3.52) 46.09,5.57 arc(47.33,9.14) U34.15
$1N7413: length 12.6
  Top Layer w0.5: v1(49.02,12.89) arc(46.48,7.28) 48.26,1.4
$1N7419: length 12.1
  Bottom Layer w0.5: U34.10 arc(53.26,6.91) 50.8,1.4

## Copper pours and planes (outline as drawn; the poured copper is in the pictures)
GND on Top Layer: -2.05,56.37 67.93,56.37 67.93,-2.68 -2.05,-2.68
GND on Bottom Layer: -3.32,57.9 70.72,57.9 70.72,-7 -3.32,-7

Small or netless copper shapes (teardrops, artwork), in the pictures only: 127 on Top Layer, 134 on Bottom Layer
